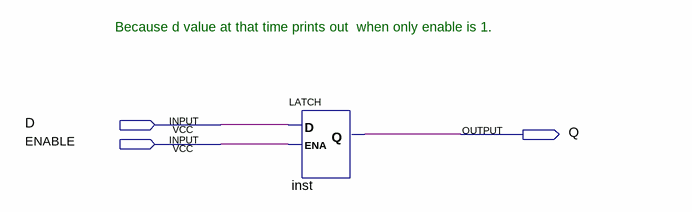
[diagram p0: schematic sheet]
// Quartus schematic practice1.bdf as structural Verilog: 1 symbols, 3 pins
module practice1 (
  input  D,
  input  ENABLE,
  output Q
);

  LATCH inst (.D(D), .ENA(ENABLE), .Q(Q));

  // Notes on the sheet:
  //   Because d value at that time prints out  when only enable is 1.
endmodule
